# EAGLE design AudioXtreamer_Ymh01x (EAGLE 9.3.0)
AUTHOR: H.H.S.S.; WEB_ADDR: github.com/eltortugo/audioxtreamer

## Sheet 1 of 2
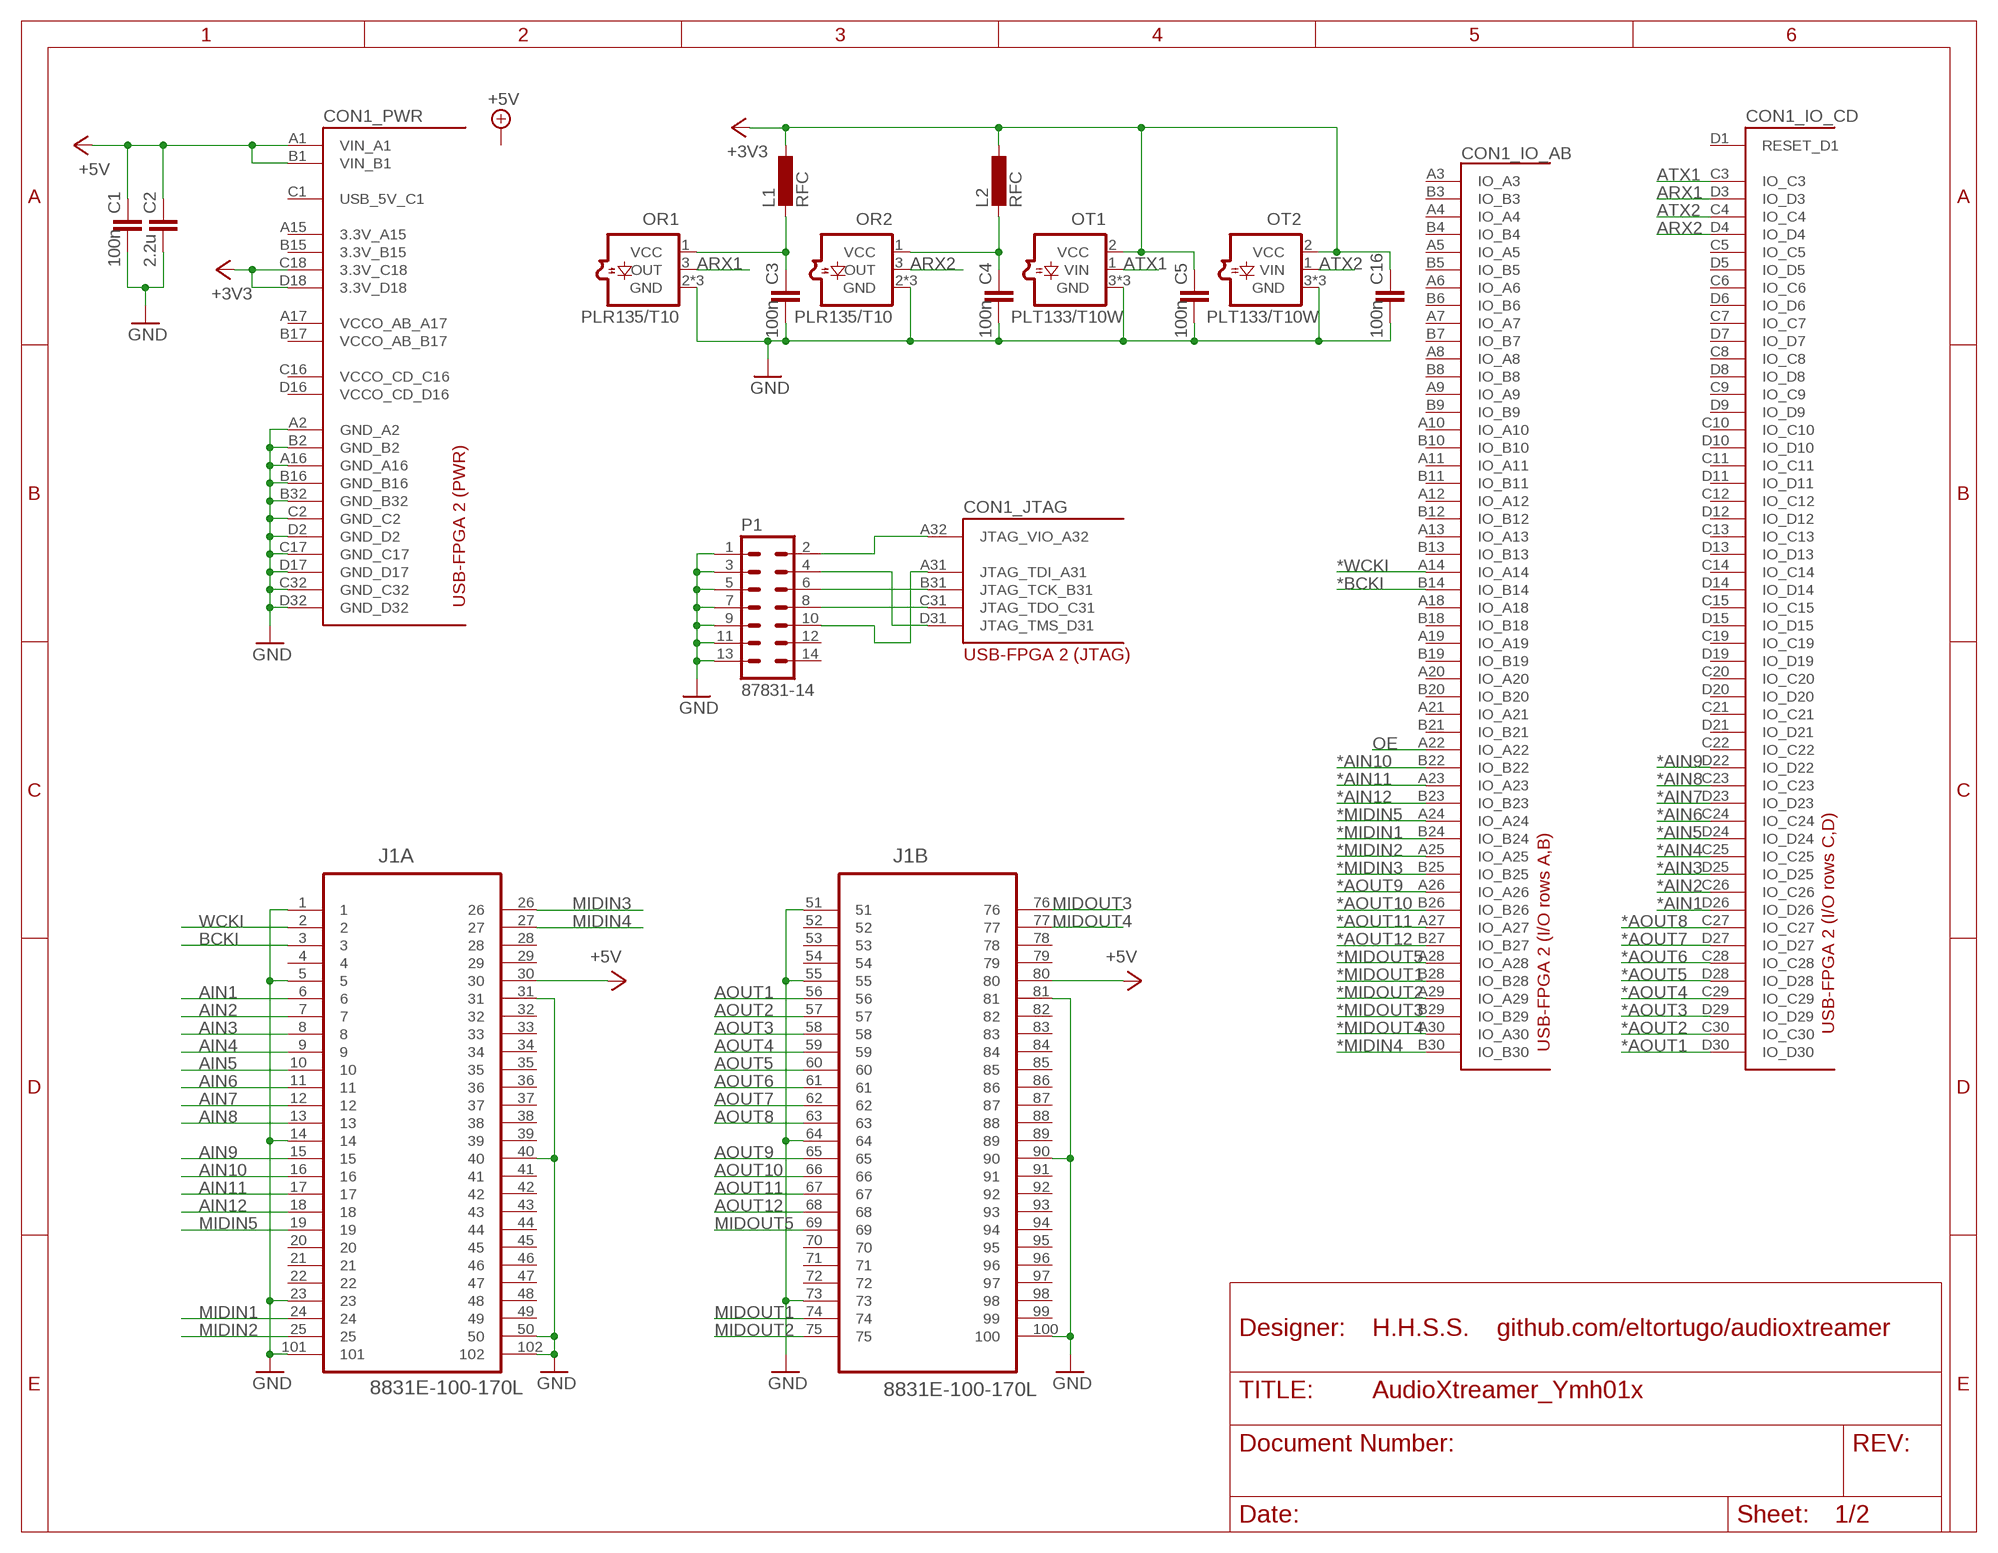
[diagram p0: schematic, sheet 1]
FRAME1 (FRAME_A_L): AUTHOR: H.H.S.S.; WEB_ADDR: github.com/eltortugo/audioxtreamer

### Parts
C1  100n  C-EUC0603  [C0603]
C2  2.2u  C-EUC0603  [C0603]
C3  100n  C-EUC0603  [C0603]
C4  100n  C-EUC0603  [C0603]
C5  100n  C-EUC0603  [C0603]
C16  100n  C-EUC0603  [C0603]
CON1  USB-FPGA-2THT  [USB-FPGA-2-THT]
J1  8831E-100-170L  [KEL_8831E-100-170L]
L1  RFC  L-EUL2012C  [L2012C]
L2  RFC  L-EUL2012C  [L2012C]
OR1  PLR135/T10  [PLR135/T10]
OR2  PLR135/T10  [PLR135/T10]
OT1  PLT133/T10W  [PLT133/T10]
OT2  PLT133/T10W  [PLT133/T10]
P1  87831-14  [87831-14]

### Nets
*AIN1: CON1.D26(_IO_CD:IO_D26) ; also sheet 2
*AIN2: CON1.C26(_IO_CD:IO_C26) ; also sheet 2
*AIN3: CON1.D25(_IO_CD:IO_D25) ; also sheet 2
*AIN4: CON1.C25(_IO_CD:IO_C25) ; also sheet 2
*AIN5: CON1.D24(_IO_CD:IO_D24) ; also sheet 2
*AIN6: CON1.C24(_IO_CD:IO_C24) ; also sheet 2
*AIN7: CON1.D23(_IO_CD:IO_D23) ; also sheet 2
*AIN8: CON1.C23(_IO_CD:IO_C23) ; also sheet 2
*AIN9: CON1.D22(_IO_CD:IO_D22) ; also sheet 2
*AIN10: CON1.B22(_IO_AB:IO_B22) ; also sheet 2
*AIN11: CON1.A23(_IO_AB:IO_A23) ; also sheet 2
*AIN12: CON1.B23(_IO_AB:IO_B23) ; also sheet 2
*AOUT1: CON1.D30(_IO_CD:IO_D30) ; also sheet 2
*AOUT2: CON1.C30(_IO_CD:IO_C30) ; also sheet 2
*AOUT3: CON1.D29(_IO_CD:IO_D29) ; also sheet 2
*AOUT4: CON1.C29(_IO_CD:IO_C29) ; also sheet 2
*AOUT5: CON1.D28(_IO_CD:IO_D28) ; also sheet 2
*AOUT6: CON1.C28(_IO_CD:IO_C28) ; also sheet 2
*AOUT7: CON1.D27(_IO_CD:IO_D27) ; also sheet 2
*AOUT8: CON1.C27(_IO_CD:IO_C27) ; also sheet 2
*AOUT9: CON1.A26(_IO_AB:IO_A26) ; also sheet 2
*AOUT10: CON1.B26(_IO_AB:IO_B26) ; also sheet 2
*AOUT11: CON1.A27(_IO_AB:IO_A27) ; also sheet 2
*AOUT12: CON1.B27(_IO_AB:IO_B27) ; also sheet 2
*BCKI: CON1.B14(_IO_AB:IO_B14) ; also sheet 2
*MIDIN1: CON1.B24(_IO_AB:IO_B24) ; also sheet 2
*MIDIN2: CON1.A25(_IO_AB:IO_A25) ; also sheet 2
*MIDIN3: CON1.B25(_IO_AB:IO_B25) ; also sheet 2
*MIDIN4: CON1.B30(_IO_AB:IO_B30) ; also sheet 2
*MIDIN5: CON1.A24(_IO_AB:IO_A24) ; also sheet 2
*MIDOUT1: CON1.B28(_IO_AB:IO_B28) ; also sheet 2
*MIDOUT2: CON1.A29(_IO_AB:IO_A29) ; also sheet 2
*MIDOUT3: CON1.B29(_IO_AB:IO_B29) ; also sheet 2
*MIDOUT4: CON1.A30(_IO_AB:IO_A30) ; also sheet 2
*MIDOUT5: CON1.A28(_IO_AB:IO_A28) ; also sheet 2
*WCKI: CON1.A14(_IO_AB:IO_A14) ; also sheet 2
+3V3: C5.1 C16.1 CON1.C18(_PWR:3.3V_C18) CON1.D18(_PWR:3.3V_D18) L1.1 L2.1 OT1.2(VCC) OT2.2(VCC) ; also sheet 2
+5V: C1.1 C2.1 CON1.A1(_PWR:VIN_A1) CON1.B1(_PWR:VIN_B1) J1.30 J1.80 ; also sheet 2
AIN1: J1.6 ; also sheet 2
AIN2: J1.7 ; also sheet 2
AIN3: J1.8 ; also sheet 2
AIN4: J1.9 ; also sheet 2
AIN5: J1.10 ; also sheet 2
AIN6: J1.11 ; also sheet 2
AIN7: J1.12 ; also sheet 2
AIN8: J1.13 ; also sheet 2
AIN9: J1.15 ; also sheet 2
AIN10: J1.16 ; also sheet 2
AIN11: J1.17 ; also sheet 2
AIN12: J1.18 ; also sheet 2
AOUT1: J1.56 ; also sheet 2
AOUT2: J1.57 ; also sheet 2
AOUT3: J1.58 ; also sheet 2
AOUT4: J1.59 ; also sheet 2
AOUT5: J1.60 ; also sheet 2
AOUT6: J1.61 ; also sheet 2
AOUT7: J1.62 ; also sheet 2
AOUT8: J1.63 ; also sheet 2
AOUT9: J1.65 ; also sheet 2
AOUT10: J1.66 ; also sheet 2
AOUT11: J1.67 ; also sheet 2
AOUT12: J1.68 ; also sheet 2
ARX1: CON1.D3(_IO_CD:IO_D3) OR1.3(OUT)
ARX2: CON1.D4(_IO_CD:IO_D4) OR2.3(OUT)
ATX1: CON1.C3(_IO_CD:IO_C3) OT1.1(VIN)
ATX2: CON1.C4(_IO_CD:IO_C4) OT2.1(VIN)
BCKI: J1.3 ; also sheet 2
GND: C1.2 C2.2 C3.2 C4.2 C5.2 C16.2 CON1.A2(_PWR:GND_A2) CON1.A16(_PWR:GND_A16) CON1.B2(_PWR:GND_B2) CON1.B16(_PWR:GND_B16) CON1.B32(_PWR:GND_B32) CON1.C2(_PWR:GND_C2) CON1.C17(_PWR:GND_C17) CON1.C32(_PWR:GND_C32) CON1.D2(_PWR:GND_D2) CON1.D17(_PWR:GND_D17) CON1.D32(_PWR:GND_D32) J1.1 J1.5 J1.14 J1.23 J1.31 J1.40 J1.50 J1.51 J1.55 J1.64 J1.73 J1.81 J1.90 J1.100 J1.101 J1.102 OR1.2(GND) OR1.NC1(GND) OR1.NC2(GND) OR2.2(GND) OR2.NC1(GND) OR2.NC2(GND) OT1.3(GND) OT1.NC1(GND) OT1.NC2(GND) OT2.3(GND) OT2.NC1(GND) OT2.NC2(GND) P1.1 P1.3 P1.5 P1.7 P1.9 P1.11 P1.13 ; also sheet 2
MIDIN1: J1.24 ; also sheet 2
MIDIN2: J1.25 ; also sheet 2
MIDIN3: J1.26 ; also sheet 2
MIDIN4: J1.27 ; also sheet 2
MIDIN5: J1.19 ; also sheet 2
MIDOUT1: J1.74 ; also sheet 2
MIDOUT2: J1.75 ; also sheet 2
MIDOUT3: J1.76 ; also sheet 2
MIDOUT4: J1.77 ; also sheet 2
MIDOUT5: J1.69 ; also sheet 2
N$1: CON1.A32(_JTAG:JTAG_VIO_A32) P1.2
N$2: CON1.D31(_JTAG:JTAG_TMS_D31) P1.4
N$3: CON1.B31(_JTAG:JTAG_TCK_B31) P1.6
N$4: CON1.C31(_JTAG:JTAG_TDO_C31) P1.8
N$5: CON1.A31(_JTAG:JTAG_TDI_A31) P1.10
N$7: C3.1 L1.2 OR1.1(VCC)
N$8: C4.1 L2.2 OR2.1(VCC)
OE: CON1.A22(_IO_AB:IO_A22) ; also sheet 2
WCKI: J1.2 ; also sheet 2
Unconnected: CON1.A3(_IO_AB:IO_A3) CON1.A4(_IO_AB:IO_A4) CON1.A5(_IO_AB:IO_A5) CON1.A6(_IO_AB:IO_A6) CON1.A7(_IO_AB:IO_A7) CON1.A8(_IO_AB:IO_A8) CON1.A9(_IO_AB:IO_A9) CON1.A10(_IO_AB:IO_A10) CON1.A11(_IO_AB:IO_A11) CON1.A12(_IO_AB:IO_A12) CON1.A13(_IO_AB:IO_A13) CON1.A15(_PWR:3.3V_A15) CON1.A17(_PWR:VCCO_AB_A17) CON1.A18(_IO_AB:IO_A18) CON1.A19(_IO_AB:IO_A19) CON1.A20(_IO_AB:IO_A20) CON1.A21(_IO_AB:IO_A21) CON1.B3(_IO_AB:IO_B3) CON1.B4(_IO_AB:IO_B4) CON1.B5(_IO_AB:IO_B5) CON1.B6(_IO_AB:IO_B6) CON1.B7(_IO_AB:IO_B7) CON1.B8(_IO_AB:IO_B8) CON1.B9(_IO_AB:IO_B9) CON1.B10(_IO_AB:IO_B10) CON1.B11(_IO_AB:IO_B11) CON1.B12(_IO_AB:IO_B12) CON1.B13(_IO_AB:IO_B13) CON1.B15(_PWR:3.3V_B15) CON1.B17(_PWR:VCCO_AB_B17) CON1.B18(_IO_AB:IO_B18) CON1.B19(_IO_AB:IO_B19) CON1.B20(_IO_AB:IO_B20) CON1.B21(_IO_AB:IO_B21) CON1.C1(_PWR:USB_5V_C1) CON1.C5(_IO_CD:IO_C5) CON1.C6(_IO_CD:IO_C6) CON1.C7(_IO_CD:IO_C7) CON1.C8(_IO_CD:IO_C8) CON1.C9(_IO_CD:IO_C9) CON1.C10(_IO_CD:IO_C10) CON1.C11(_IO_CD:IO_C11) CON1.C12(_IO_CD:IO_C12) CON1.C13(_IO_CD:IO_C13) CON1.C14(_IO_CD:IO_C14) CON1.C15(_IO_CD:IO_C15) CON1.C16(_PWR:VCCO_CD_C16) CON1.C19(_IO_CD:IO_C19) CON1.C20(_IO_CD:IO_C20) CON1.C21(_IO_CD:IO_C21) CON1.C22(_IO_CD:IO_C22) CON1.D1(_IO_CD:RESET_D1) CON1.D5(_IO_CD:IO_D5) CON1.D6(_IO_CD:IO_D6) CON1.D7(_IO_CD:IO_D7) CON1.D8(_IO_CD:IO_D8) CON1.D9(_IO_CD:IO_D9) CON1.D10(_IO_CD:IO_D10) CON1.D11(_IO_CD:IO_D11) CON1.D12(_IO_CD:IO_D12) CON1.D13(_IO_CD:IO_D13) CON1.D14(_IO_CD:IO_D14) CON1.D15(_IO_CD:IO_D15) CON1.D16(_PWR:VCCO_CD_D16) CON1.D19(_IO_CD:IO_D19) CON1.D20(_IO_CD:IO_D20) CON1.D21(_IO_CD:IO_D21) J1.4 J1.20 J1.21 J1.22 J1.28 J1.29 J1.32 J1.33 J1.34 J1.35 J1.36 J1.37 J1.38 J1.39 J1.41 J1.42 J1.43 J1.44 J1.45 J1.46 J1.47 J1.48 J1.49 J1.52 J1.53 J1.54 J1.70 J1.71 J1.72 J1.78 J1.79 J1.82 J1.83 J1.84 J1.85 J1.86 J1.87 J1.88 J1.89 J1.91 J1.92 J1.93 J1.94 J1.95 J1.96 J1.97 J1.98 J1.99 P1.12 P1.14

### Notes on the sheet
- Designer:

## Sheet 2 of 2
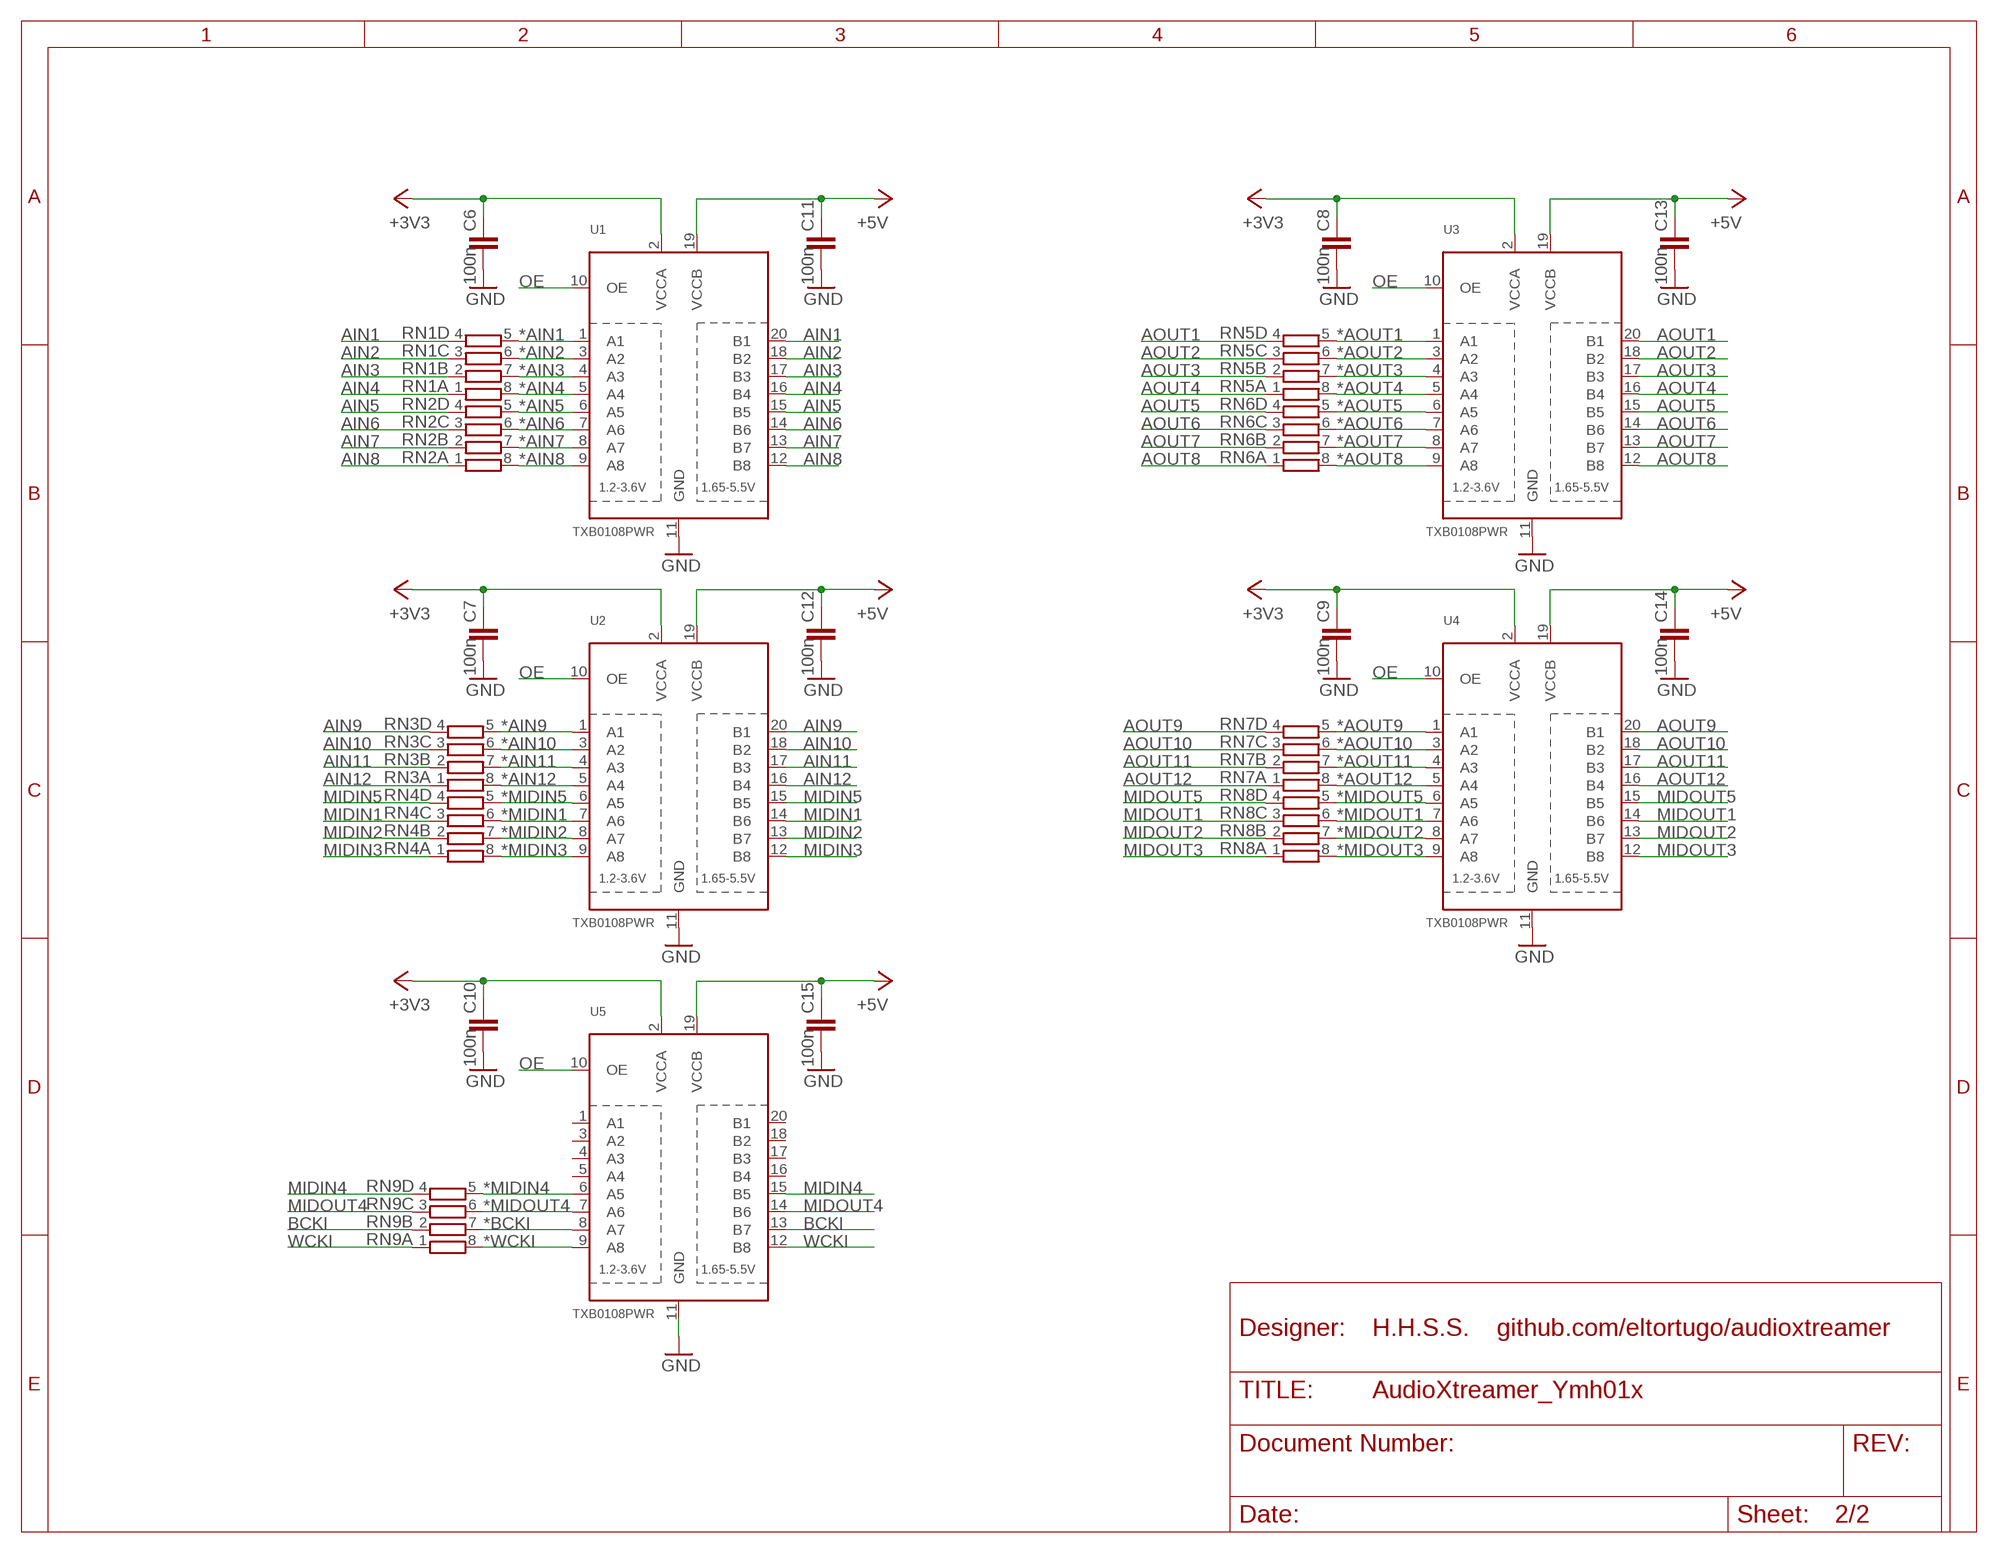
[diagram p1: schematic, sheet 2]
FRAME2 (FRAME_A_L): AUTHOR: H.Soto; WEB_ADDR: github.com/eltortugo/audioxtreamer
FRAME3 (FRAME_A_L): AUTHOR: >AUTHOR

### Parts
C6  100n  C-EUC0603  [C0603]
C7  100n  C-EUC0603  [C0603]
C8  100n  C-EUC0603  [C0603]
C9  100n  C-EUC0603  [C0603]
C10  100n  C-EUC0603  [C0603]
C11  100n  C-EUC0603  [C0603]
C12  100n  C-EUC0603  [C0603]
C13  100n  C-EUC0603  [C0603]
C14  100n  C-EUC0603  [C0603]
C15  100n  C-EUC0603  [C0603]
RN1  4R-N0603-ARC  [0603-ARC]
RN2  4R-N0603-ARC  [0603-ARC]
RN3  4R-N0603-ARC  [0603-ARC]
RN4  4R-N0603-ARC  [0603-ARC]
RN5  4R-N0603-ARC  [0603-ARC]
RN6  4R-N0603-ARC  [0603-ARC]
RN7  4R-N0603-ARC  [0603-ARC]
RN8  4R-N0603-ARC  [0603-ARC]
RN9  4R-N0603-ARC  [0603-ARC]
U1  TXB0108PWR  [TSSOP20]
U2  TXB0108PWR  [TSSOP20]
U3  TXB0108PWR  [TSSOP20]
U4  TXB0108PWR  [TSSOP20]
U5  TXB0108PWR  [TSSOP20]

### Nets
*AIN1: RN1.5 U1.1(A1) ; also sheet 1
*AIN2: RN1.6 U1.3(A2) ; also sheet 1
*AIN3: RN1.7 U1.4(A3) ; also sheet 1
*AIN4: RN1.8 U1.5(A4) ; also sheet 1
*AIN5: RN2.5 U1.6(A5) ; also sheet 1
*AIN6: RN2.6 U1.7(A6) ; also sheet 1
*AIN7: RN2.7 U1.8(A7) ; also sheet 1
*AIN8: RN2.8 U1.9(A8) ; also sheet 1
*AIN9: RN3.5 U2.1(A1) ; also sheet 1
*AIN10: RN3.6 U2.3(A2) ; also sheet 1
*AIN11: RN3.7 U2.4(A3) ; also sheet 1
*AIN12: RN3.8 U2.5(A4) ; also sheet 1
*AOUT1: RN5.5 U3.1(A1) ; also sheet 1
*AOUT2: RN5.6 U3.3(A2) ; also sheet 1
*AOUT3: RN5.7 U3.4(A3) ; also sheet 1
*AOUT4: RN5.8 U3.5(A4) ; also sheet 1
*AOUT5: RN6.5 U3.6(A5) ; also sheet 1
*AOUT6: RN6.6 U3.7(A6) ; also sheet 1
*AOUT7: RN6.7 U3.8(A7) ; also sheet 1
*AOUT8: RN6.8 U3.9(A8) ; also sheet 1
*AOUT9: RN7.5 U4.1(A1) ; also sheet 1
*AOUT10: RN7.6 U4.3(A2) ; also sheet 1
*AOUT11: RN7.7 U4.4(A3) ; also sheet 1
*AOUT12: RN7.8 U4.5(A4) ; also sheet 1
*BCKI: RN9.7 U5.8(A7) ; also sheet 1
*MIDIN1: RN4.6 U2.7(A6) ; also sheet 1
*MIDIN2: RN4.7 U2.8(A7) ; also sheet 1
*MIDIN3: RN4.8 U2.9(A8) ; also sheet 1
*MIDIN4: RN9.5 U5.6(A5) ; also sheet 1
*MIDIN5: RN4.5 U2.6(A5) ; also sheet 1
*MIDOUT1: RN8.6 U4.7(A6) ; also sheet 1
*MIDOUT2: RN8.7 U4.8(A7) ; also sheet 1
*MIDOUT3: RN8.8 U4.9(A8) ; also sheet 1
*MIDOUT4: RN9.6 U5.7(A6) ; also sheet 1
*MIDOUT5: RN8.5 U4.6(A5) ; also sheet 1
*WCKI: RN9.8 U5.9(A8) ; also sheet 1
+3V3: C6.1 C7.1 C8.1 C9.1 C10.1 U1.2(VCCA) U2.2(VCCA) U3.2(VCCA) U4.2(VCCA) U5.2(VCCA) ; also sheet 1
+5V: C11.1 C12.1 C13.1 C14.1 C15.1 U1.19(VCCB) U2.19(VCCB) U3.19(VCCB) U4.19(VCCB) U5.19(VCCB) ; also sheet 1
AIN1: RN1.4 U1.20(B1) ; also sheet 1
AIN2: RN1.3 U1.18(B2) ; also sheet 1
AIN3: RN1.2 U1.17(B3) ; also sheet 1
AIN4: RN1.1 U1.16(B4) ; also sheet 1
AIN5: RN2.4 U1.15(B5) ; also sheet 1
AIN6: RN2.3 U1.14(B6) ; also sheet 1
AIN7: RN2.2 U1.13(B7) ; also sheet 1
AIN8: RN2.1 U1.12(B8) ; also sheet 1
AIN9: RN3.4 U2.20(B1) ; also sheet 1
AIN10: RN3.3 U2.18(B2) ; also sheet 1
AIN11: RN3.2 U2.17(B3) ; also sheet 1
AIN12: RN3.1 U2.16(B4) ; also sheet 1
AOUT1: RN5.4 U3.20(B1) ; also sheet 1
AOUT2: RN5.3 U3.18(B2) ; also sheet 1
AOUT3: RN5.2 U3.17(B3) ; also sheet 1
AOUT4: RN5.1 U3.16(B4) ; also sheet 1
AOUT5: RN6.4 U3.15(B5) ; also sheet 1
AOUT6: RN6.3 U3.14(B6) ; also sheet 1
AOUT7: RN6.2 U3.13(B7) ; also sheet 1
AOUT8: RN6.1 U3.12(B8) ; also sheet 1
AOUT9: RN7.4 U4.20(B1) ; also sheet 1
AOUT10: RN7.3 U4.18(B2) ; also sheet 1
AOUT11: RN7.2 U4.17(B3) ; also sheet 1
AOUT12: RN7.1 U4.16(B4) ; also sheet 1
BCKI: RN9.2 U5.13(B7) ; also sheet 1
GND: C6.2 C7.2 C8.2 C9.2 C10.2 C11.2 C12.2 C13.2 C14.2 C15.2 U1.11(GND) U2.11(GND) U3.11(GND) U4.11(GND) U5.11(GND) ; also sheet 1
MIDIN1: RN4.3 U2.14(B6) ; also sheet 1
MIDIN2: RN4.2 U2.13(B7) ; also sheet 1
MIDIN3: RN4.1 U2.12(B8) ; also sheet 1
MIDIN4: RN9.4 U5.15(B5) ; also sheet 1
MIDIN5: RN4.4 U2.15(B5) ; also sheet 1
MIDOUT1: RN8.3 U4.14(B6) ; also sheet 1
MIDOUT2: RN8.2 U4.13(B7) ; also sheet 1
MIDOUT3: RN8.1 U4.12(B8) ; also sheet 1
MIDOUT4: RN9.3 U5.14(B6) ; also sheet 1
MIDOUT5: RN8.4 U4.15(B5) ; also sheet 1
OE: U1.10(OE) U2.10(OE) U3.10(OE) U4.10(OE) U5.10(OE) ; also sheet 1
WCKI: RN9.1 U5.12(B8) ; also sheet 1
Unconnected: U5.1(A1) U5.3(A2) U5.4(A3) U5.5(A4) U5.16(B4) U5.17(B3) U5.18(B2) U5.20(B1)

### Notes on the sheet
- Designer:

## Library data of the parts
C1-C16 = rcl:C-EU: CAPACITOR, European symbol; SPICEPREFIX: C
CON1 = ztex-fpga-2:USB-FPGA-2
J1 = KEL:8831E-100-170L: CONN RCPT 1.27MM 100POS GOLD PCB; DESCRIPTION: CONN-100POS; MPN: KEL_8831E-100-170L; ROHS: Yes; SUPPLIER: KEL
L1 L2 = rcl:L-EU: INDUCTOR, European symbol; SPICEPREFIX: L
OR1 OR2 = everlight:PLR135/T10
OT1 OT2 = everlight:PLT133/T10W
P1 = con-molex-milli-grid:87831-14: HEADER
RN1-RN9 = resistor-dil:4R-N: Array Chip Resistor Source: RS Component / Phycomp; OC_FARNELL: unknown; OC_NEWARK: unknown
U1-U5 = adafruit:TXB0108PWR: 8-Bit Bi-Directional Level Shifter 1.2V-3.6V (VCCA) to 1.65V-5.5V (VCCB) bi-directional level shifter with auto direction sensing. Max data rate - VCCA 1.8V: 20Mbps (50ns), VCCA 3.3V: 100Mbps (10ns) Digikey: 296-21527-1-ND

## Net classes
1 +5V: width 0.635 mm

## Board
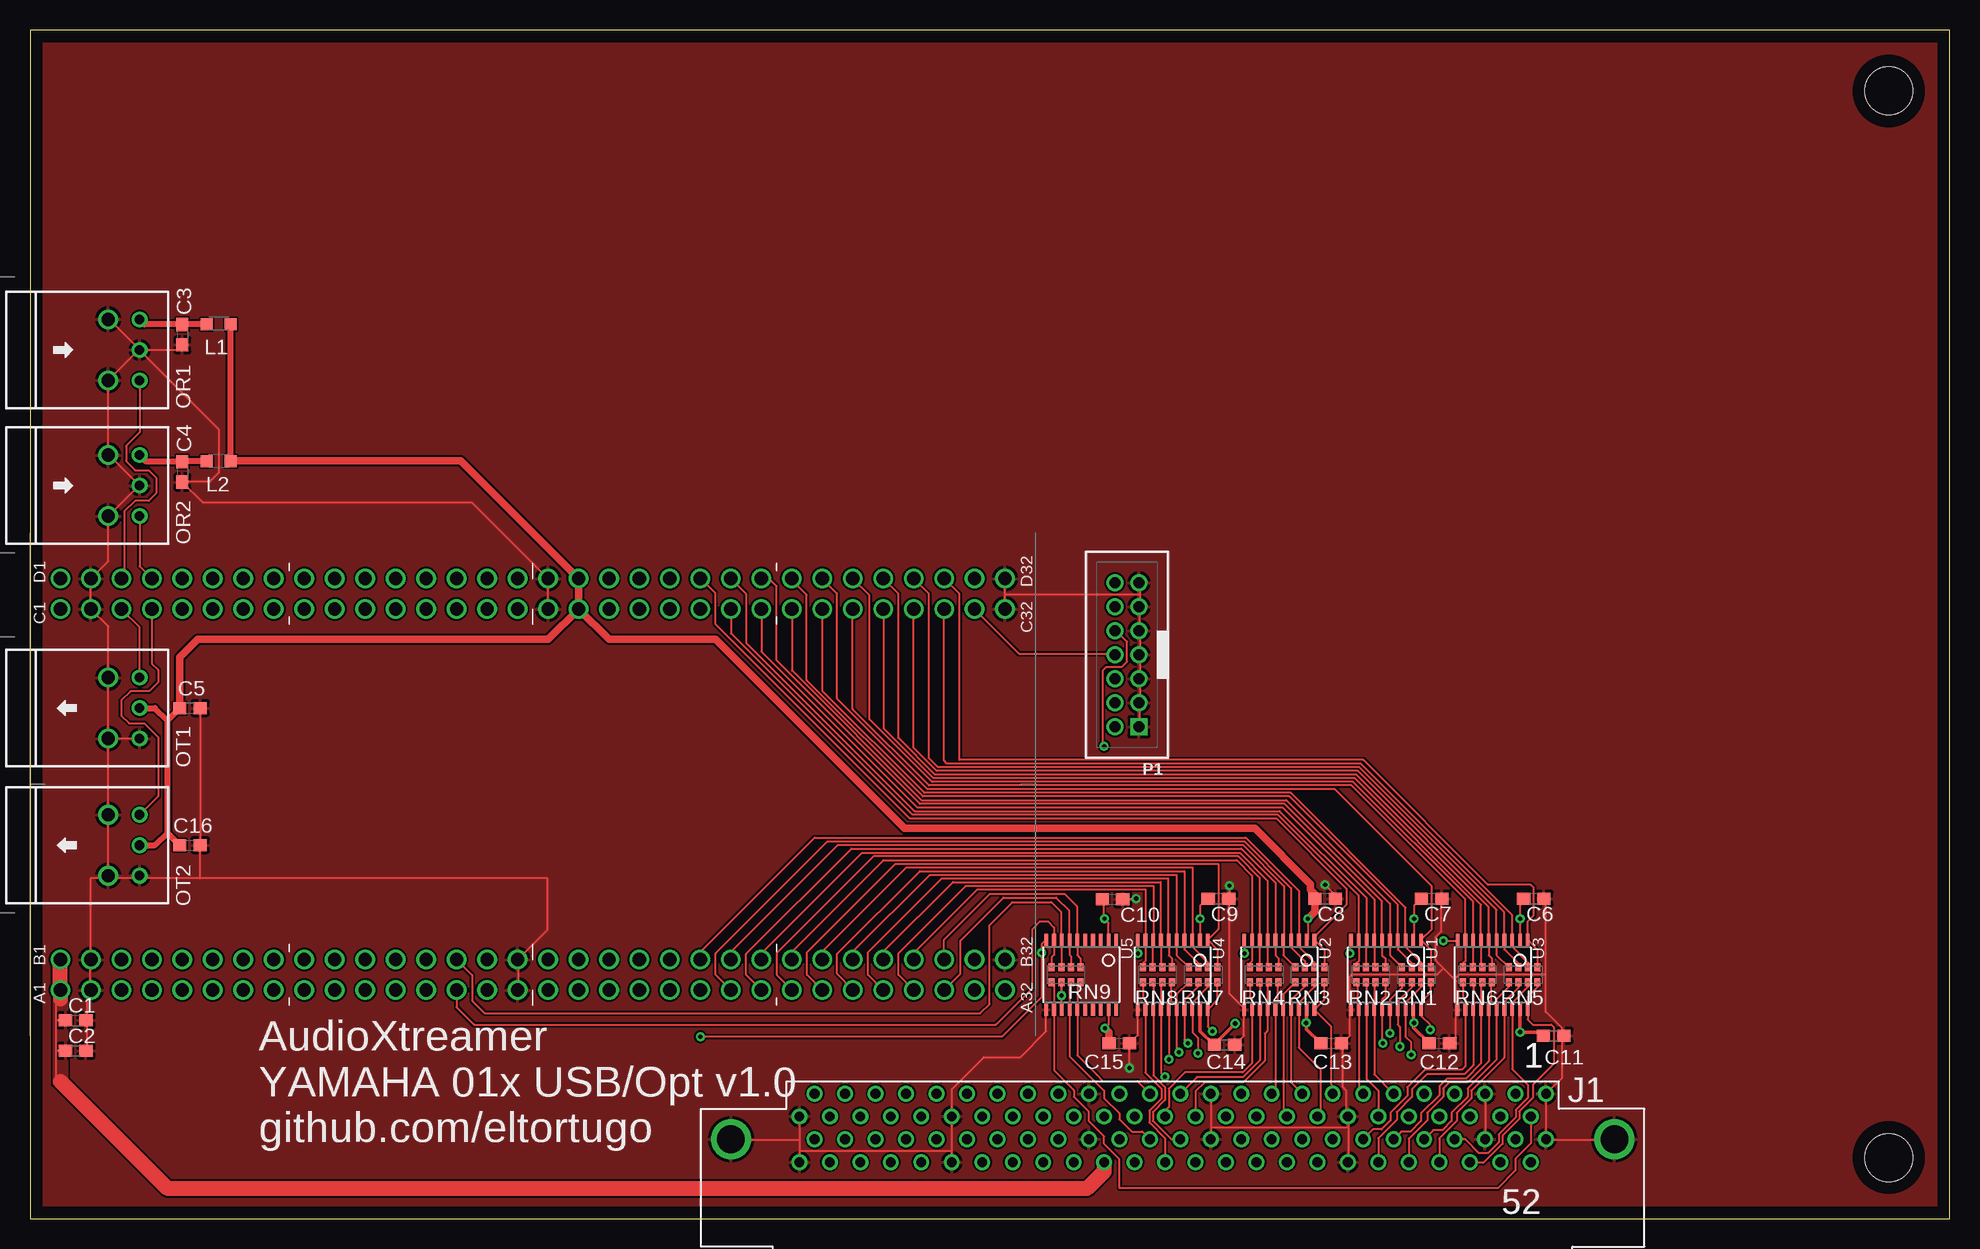
[diagram p2: board, top side]
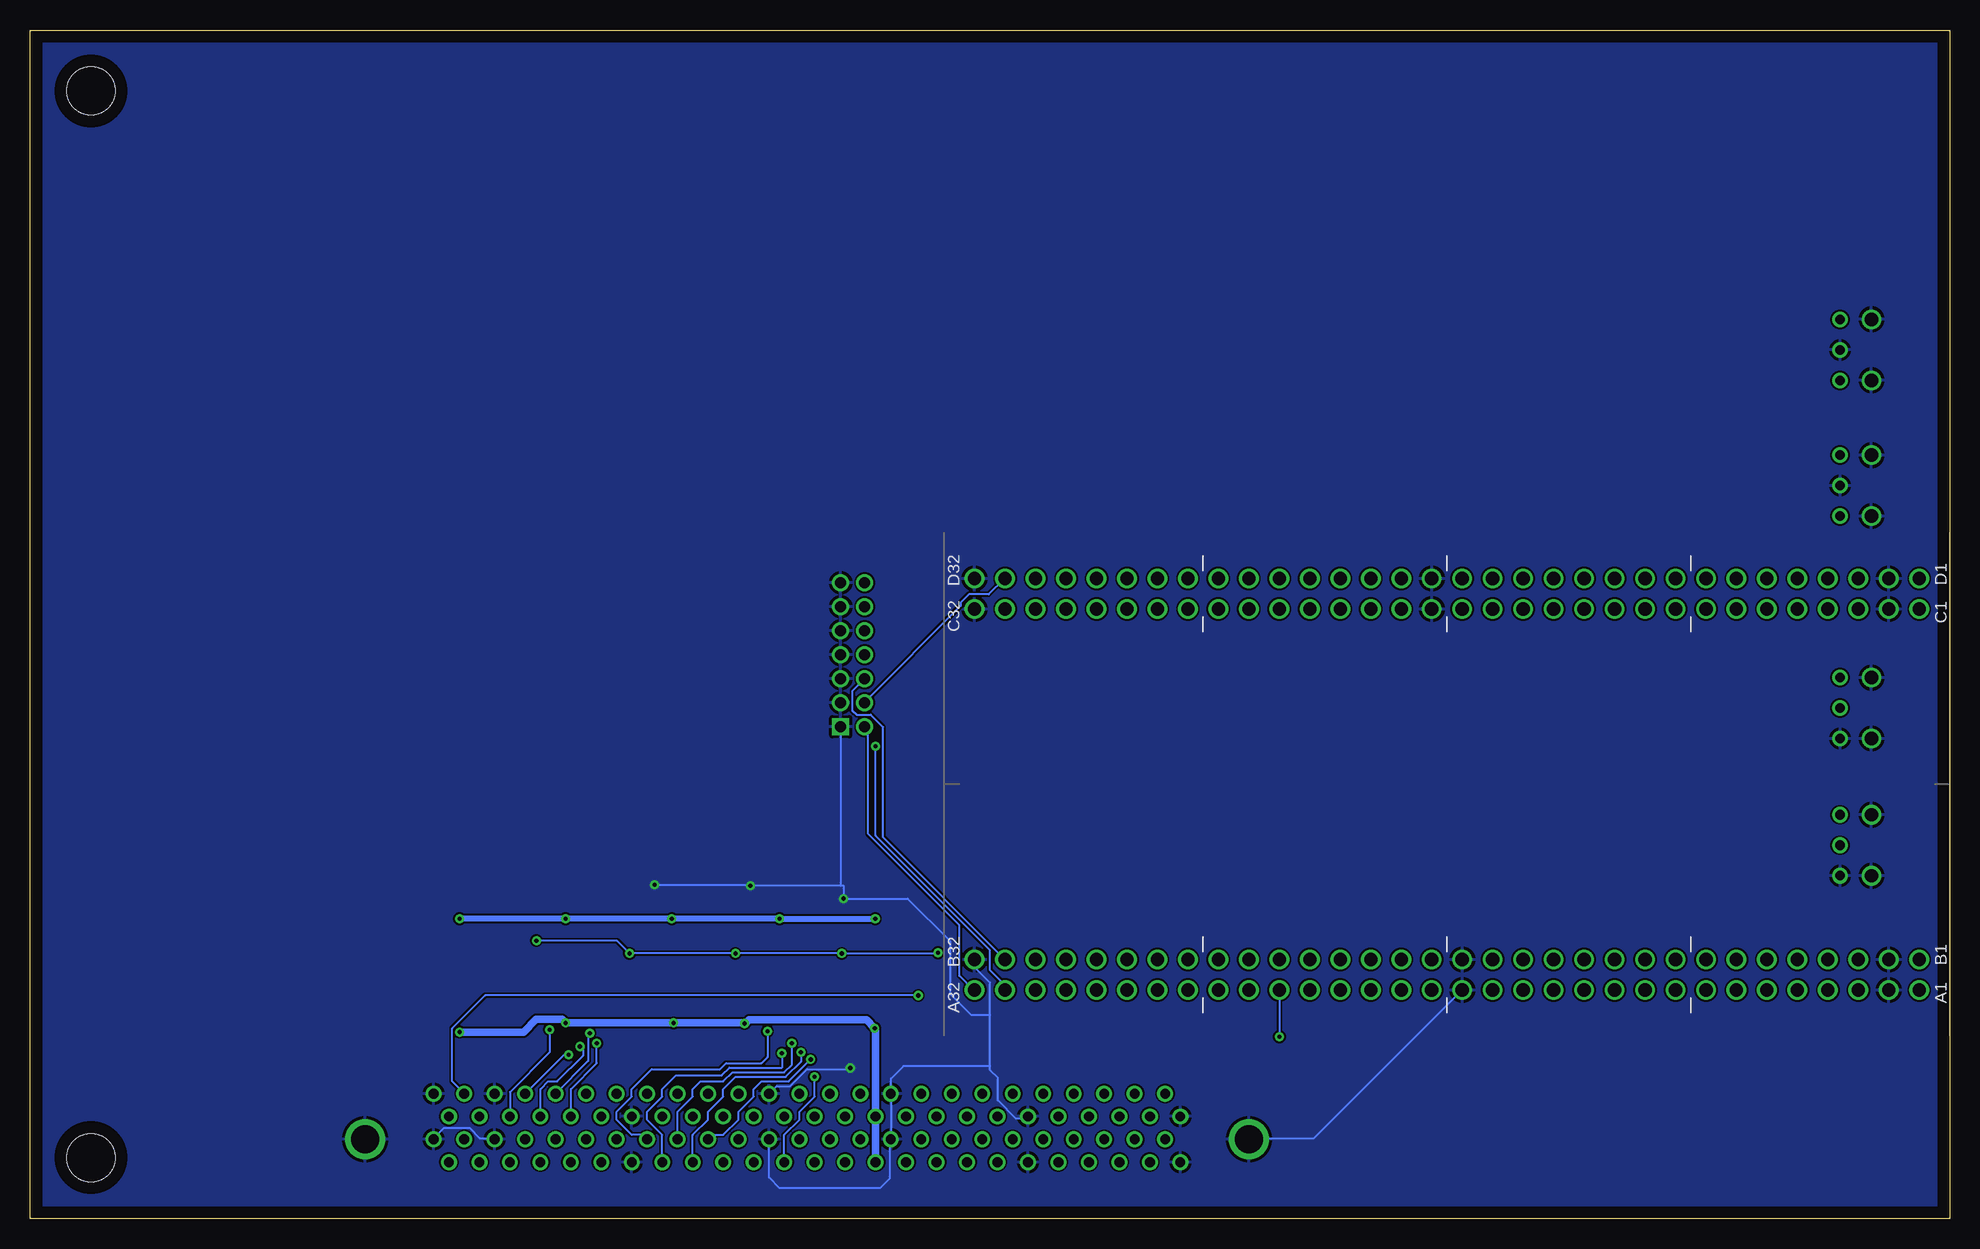
[diagram p3: board, bottom side, seen from below]

Size 160.02 x 99.05 mm. Coordinates in mm from the lower left corner, seen from the top.
Outline: 0,0 160.02,0 160.02,99.05 0,99.05 0,0
Copper layers (1*16): Top 0.035mm / dielectric 1.5mm / Bottom 0.035mm
Design rules "default *": minimum track width 6mil, minimum drill 0.35mm, track to track 6mil, track to pad 8mil, pad to pad 6mil, via to via 6mil, smd to smd 6mil, copper to edge 40mil, drill to drill 6mil, minimum pad ring 10mil, minimum via ring 8mil, stop-mask expansion 4mil, vias tented up to drill 0mil, thermal gap 10mil
Holes 4 mm at 154.94,5.08 154.94,93.98

### Footprints (pad centres in the part's own frame; a part is rotated, then mirrored left to right if it is on the bottom)
C0603 = smd 1.1 x 1: 1 -0.85,0; 2 0.85,0
USB-FPGA-2-THT = drill 1.1: A1 2.54,2.54; A2 5.08,2.54; A3 7.62,2.54; A4 10.16,2.54; A5 12.7,2.54; A6 15.24,2.54; A7 17.78,2.54; A8 20.32,2.54; A9 22.86,2.54; A10 25.4,2.54; A11 27.94,2.54; A12 30.48,2.54; A13 33.02,2.54; A14 35.56,2.54; A15 38.1,2.54; A16 40.64,2.54; A17 43.18,2.54; A18 45.72,2.54; A19 48.26,2.54; A20 50.8,2.54; A21 53.34,2.54; A22 55.88,2.54; A23 58.42,2.54; A24 60.96,2.54; A25 63.5,2.54; A26 66.04,2.54; A27 68.58,2.54; A28 71.12,2.54; A29 73.66,2.54; A30 76.2,2.54; A31 78.74,2.54; A32 81.28,2.54; B1 2.54,5.08; B2 5.08,5.08; B3 7.62,5.08; B4 10.16,5.08; B5 12.7,5.08; B6 15.24,5.08; B7 17.78,5.08; B8 20.32,5.08; B9 22.86,5.08; B10 25.4,5.08; B11 27.94,5.08; B12 30.48,5.08; B13 33.02,5.08; B14 35.56,5.08; B15 38.1,5.08; B16 40.64,5.08; B17 43.18,5.08; B18 45.72,5.08; B19 48.26,5.08; B20 50.8,5.08; B21 53.34,5.08; B22 55.88,5.08; B23 58.42,5.08; B24 60.96,5.08; B25 63.5,5.08; B26 66.04,5.08; B27 68.58,5.08; B28 71.12,5.08; B29 73.66,5.08; B30 76.2,5.08; B31 78.74,5.08; B32 81.28,5.08; C1 2.54,34.29; C2 5.08,34.29; C3 7.62,34.29; C4 10.16,34.29; C5 12.7,34.29; C6 15.24,34.29; C7 17.78,34.29; C8 20.32,34.29; C9 22.86,34.29; C10 25.4,34.29; C11 27.94,34.29; C12 30.48,34.29; C13 33.02,34.29; C14 35.56,34.29; C15 38.1,34.29; C16 40.64,34.29; C17 43.18,34.29; C18 45.72,34.29; C19 48.26,34.29; C20 50.8,34.29; C21 53.34,34.29; C22 55.88,34.29; C23 58.42,34.29; C24 60.96,34.29; C25 63.5,34.29; C26 66.04,34.29; C27 68.58,34.29; C28 71.12,34.29; C29 73.66,34.29; C30 76.2,34.29; C31 78.74,34.29; C32 81.28,34.29; D1 2.54,36.83; D2 5.08,36.83; D3 7.62,36.83; D4 10.16,36.83; D5 12.7,36.83; D6 15.24,36.83; D7 17.78,36.83; D8 20.32,36.83; D9 22.86,36.83; D10 25.4,36.83; D11 27.94,36.83; D12 30.48,36.83; D13 33.02,36.83; D14 35.56,36.83; D15 38.1,36.83; D16 40.64,36.83; D17 43.18,36.83; D18 45.72,36.83; D19 48.26,36.83; D20 50.8,36.83; D21 53.34,36.83; D22 55.88,36.83; D23 58.42,36.83; D24 60.96,36.83; D25 63.5,36.83; D26 66.04,36.83; D27 68.58,36.83; D28 71.12,36.83; D29 73.66,36.83; D30 76.2,36.83; D31 78.74,36.83; D32 81.28,36.83
KEL_8831E-100-170L = drill 0.813: 1 31.115,3.81; 2 29.845,1.905; 3 28.575,3.81; 4 27.305,1.905; 5 26.035,3.81; 6 24.765,1.905; 7 23.495,3.81; 8 22.225,1.905; 9 20.955,3.81; 10 19.685,1.905; 11 18.415,3.81; 12 17.145,1.905; 13 15.875,3.81; 14 14.605,1.905; 15 13.335,3.81; 16 12.065,1.905; 17 10.795,3.81; 18 9.525,1.905; 19 8.255,3.81; 20 6.985,1.905; 21 5.715,3.81; 22 4.445,1.905; 23 3.175,3.81; 24 1.905,1.905; 25 0.635,3.81; 26 -0.635,1.905; 27 -1.905,3.81; 28 -3.175,1.905; 29 -4.445,3.81; 30 -5.715,1.905; 31 -6.985,3.81; 32 -8.255,1.905; 33 -9.525,3.81; 34 -10.795,1.905; 35 -12.065,3.81; 36 -13.335,1.905; 37 -14.605,3.81; 38 -15.875,1.905; 39 -17.145,3.81; 40 -18.415,1.905; 41 -19.685,3.81; 42 -20.955,1.905; 43 -22.225,3.81; 44 -23.495,1.905; 45 -24.765,3.81; 46 -26.035,1.905; 47 -27.305,3.81; 48 -28.575,1.905; 49 -29.845,3.81; 50 -31.115,1.905; 51 31.115,0; 52 29.845,-1.905; 53 28.575,0; 54 27.305,-1.905; 55 26.035,0; 56 24.765,-1.905; 57 23.495,0; 58 22.225,-1.905; 59 20.955,0; 60 19.685,-1.905; 61 18.415,0; 62 17.145,-1.905; 63 15.875,0; 64 14.605,-1.905; 65 13.335,0; 66 12.065,-1.905; 67 10.795,0; 68 9.525,-1.905; 69 8.255,0; 70 6.985,-1.905; 71 5.715,0; 72 4.445,-1.905; 73 3.175,0; 74 1.905,-1.905; 75 0.635,0; 76 -0.635,-1.905; 77 -1.905,0; 78 -3.175,-1.905; 79 -4.445,0; 80 -5.715,-1.905; 81 -6.985,0; 82 -8.255,-1.905; 83 -9.525,0; 84 -10.795,-1.905; 85 -12.065,0; 86 -13.335,-1.905; 87 -14.605,0; 88 -15.875,-1.905; 89 -17.145,0; 90 -18.415,-1.905; 91 -19.685,0; 92 -20.955,-1.905; 93 -22.225,0; 94 -23.495,-1.905; 95 -24.765,0; 96 -26.035,-1.905; 97 -27.305,0; 98 -28.575,-1.905; 99 -29.845,0; 100 -31.115,-1.905 | drill 2.311: 101 -36.83,0; 102 36.83,0
L2012C = smd 1 x 1: 1 -1,0; 2 1,0
PLR135/T10 = drill 0.8 pad 1.27: 1 -2.54,8.76; 2 0,8.76; 3 2.54,8.76 | drill 1.1: NC1 -2.54,6.14; NC2 2.54,6.14
PLT133/T10 = drill 0.8 pad 1.27: 1 -2.54,8.76; 2 0,8.76; 3 2.54,8.76 | drill 1.1: NC1 -2.54,6.14; NC2 2.54,6.14
87831-14 = drill 0.914 square: 1 -6,-1 | drill 0.914: 2 -6,1; 3 -4,-1; 4 -4,1; 5 -2,-1; 6 -2,1; 7 0,-1; 8 0,1; 9 2,-1; 10 2,1; 11 4,-1; 12 4,1; 13 6,-1; 14 6,1
0603-ARC = smd 0.5 x 0.65: 1 -1.2,-0.625; 2 -0.4,-0.625; 3 0.4,-0.625; 4 1.2,-0.625; 5 1.2,0.625; 6 0.4,0.625; 7 -0.4,0.625; 8 -1.2,0.625
TSSOP20 = smd 0.305 x 0.991: 1 -2.925,-2.918; 2 -2.275,-2.918; 3 -1.625,-2.918; 4 -0.975,-2.918; 5 -0.325,-2.918; 6 0.325,-2.918; 7 0.975,-2.918; 8 1.625,-2.918; 9 2.275,-2.918; 10 2.925,-2.918; 11 2.925,2.918; 12 2.275,2.918; 13 1.625,2.918; 14 0.975,2.918; 15 0.325,2.918; 16 -0.325,2.918; 17 -0.975,2.918; 18 -1.625,2.918; 19 -2.275,2.918; 20 -2.925,2.918

### Placement (x,y rotation side)
C1  3.81,16.51 0 top
C2  3.81,13.97 0 top
C3  12.7,73.66 270 top
C4  12.7,62.23 270 top
C5  13.34,42.55 0 top
C6  125.35,26.67 0 top
C7  116.84,26.67 0 top
C8  107.95,26.67 0 top
C9  99.06,26.67 0 top
C10  90.23,26.61 0 top
C11  127,15.24 0 top
C12  117.47,14.61 0 top
C13  108.46,14.61 0 top
C14  99.57,14.48 0 top
C15  90.81,14.61 0 top
C16  13.34,31.11 0 top
CON1  0,16.51 0 top
J1  95.25,6.6 0 top
L1  15.75,74.55 180 top
L2  15.75,63.12 180 top
OR1  0.38,72.39 270 top
OR2  0.38,61.09 270 top
OT1  0.38,42.55 270 top
OT2  0.38,31.11 270 top
P1  91.44,46.99 90 top
RN1  115.57,20.32 0 top
RN2  111.76,20.32 0 top
RN3  106.68,20.32 0 top
RN4  102.87,20.32 0 top
RN5  124.46,20.32 0 top
RN6  120.65,20.32 0 top
RN7  97.79,20.32 0 top
RN8  93.98,20.32 0 top
RN9  86.36,20.32 0 top
U1  113.03,20.32 180 top
U2  104.14,20.32 180 top
U3  121.92,20.32 180 top
U4  95.25,20.32 180 top
U5  87.63,20.32 180 top

### Tracks (layer width: path | path; a pad name or v marks a point on that pad's centre or on a via)
*AIN1
  Top 0.152: RN1.5 116.77,22.42 U1.1 116.84,24.12 116.84,27.72 108.77,35.79 74.81,35.79 67.27,43.33 67.27,52.07 66.04,53.31 CON1.D26
*AIN2
  Top 0.152: RN1.6 115.97,21.33 114.66,22.64 U1.3 114.66,25.91 105.09,35.48 74.56,35.48 66.04,44 CON1.C26
*AIN3
  Top 0.152: RN1.7 115.17,21.28 114,22.44 U1.4 114,26.13 104.96,35.18 74.43,35.18 64.73,44.88 64.73,51.98 63.5,53.21 CON1.D25
*AIN4
  Top 0.152: RN1.8 113.36,21.96 U1.5 113.36,26.24 104.72,34.87 74.3,34.87 63.5,45.68 CON1.C25
*AIN5
  Top 0.152: RN2.5 112.96,21.69 112.7,21.94 U1.6 112.7,26.44 104.58,34.57 74.18,34.57 62.23,46.52 62.23,52.7 61.59,53.34 CON1.D24
*AIN6
  Top 0.152: RN2.6 112.06,21.05 U1.7 112.06,26.6 104.39,34.27 73.94,34.27 60.96,47.24 CON1.C24
*AIN7
  Top 0.152: RN2.7 111.36,23.19 U1.8 111.41,26.72 104.17,33.96 73.74,33.96 59.69,48.01 59.69,52.07 CON1.D23
*AIN8
  Top 0.152: RN2.8 110.56,21.27 110.75,21.46 U1.9 110.75,26.91 104.01,33.66 73.54,33.66 58.42,48.78 CON1.C23
*AIN9
  Top 0.152: RN3.5 107.88,22.42 U2.1 107.06,23.49 109.73,26.15 109.73,27.51 103.89,33.35 73.33,33.35 57.12,49.55 57.12,52.15 55.93,53.34 CON1.D22
*AIN10
  Top 0.152: RN3.6 107.08,21.33 105.77,22.64 105.77,23.11 105.77,23.16 U2.3 105.79,23.26 105.79,27.3 101.35,31.75 65.41,31.75 55.88,22.23 CON1.B22
*AIN11
  Top 0.152: RN3.7 106.28,21.46 105.11,22.63 U2.4 105.11,27.55 101.22,31.45 66.5,31.45 57.15,22.1 57.15,20.32 CON1.A23
*AIN12
  Top 0.152: RN3.8 104.47,21.96 U2.5 104.52,23.29 104.52,27.71 101.09,31.14 67.33,31.14 58.42,22.23 CON1.B23
*AOUT1
  Top 0.152: RN5.5 125.66,22.42 U3.1 124.84,24.77 125.35,25.27 125.35,27.56 125.09,27.81 121.54,27.81 111.12,38.23 77.47,38.23 77.47,52.07 CON1.D30
*AOUT2
  Top 0.152: RN5.6 124.86,21.33 123.55,22.64 U3.3 123.55,25.3 110.92,37.92 76.45,37.92 76.2,38.18 CON1.C30
*AOUT3
  Top 0.152: RN5.7 124.06,21.28 122.89,22.44 U3.4 122.89,25.52 110.8,37.62 75.69,37.62 74.93,38.38 74.93,52.07 CON1.D29
*AOUT4
  Top 0.152: RN5.8 122.25,21.96 U3.5 122.25,25.74 110.67,37.31 75.57,37.31 73.66,39.22 CON1.C29
*AOUT5
  Top 0.152: RN6.5 121.85,21.69 121.59,21.94 U3.6 121.59,25.96 110.54,37.01 75.44,37.01 72.39,40.06 72.39,52.07 CON1.D28
*AOUT6
  Top 0.152: RN6.6 120.94,21.05 U3.7 120.94,26.18 110.42,36.7 75.31,36.7 71.16,40.86 71.16,50.76 CON1.C28
*AOUT7
  Top 0.152: RN6.7 120.25,23.19 U3.8 120.3,26.39 110.29,36.4 75.19,36.4 69.98,41.61 69.98,51.94 CON1.D27
*AOUT8
  Top 0.152: RN6.8 119.45,21.27 119.64,21.46 U3.9 119.64,26.61 110.16,36.09 74.94,36.09 68.58,42.45 CON1.C27
*AOUT9
  Top 0.152: RN7.5 98.99,22.42 U4.1 99.06,24.12 99.06,29.57 72.14,29.57 64.77,22.19 64.77,20.32 CON1.A26
*AOUT10
  Top 0.152: U4.3 96.88,22.86 | 96.88,22.86 96.88,22.64 98.19,21.33 RN7.6 | 96.88,22.86 96.9,22.89 96.9,29.26 73.08,29.26 66.04,22.23 CON1.B26
*AOUT11
  Top 0.152: RN7.7 97.39,21.28 96.22,22.44 U4.4 96.22,28.96 74.17,28.96 67.27,22.06 67.27,20.39 68.58,19.08 CON1.A27
*AOUT12
  Top 0.152: RN7.8 95.58,21.96 U4.5 95.58,28.65 75.01,28.65 68.58,22.23 CON1.B27
*BCKI
  Top 0.152: CON1.B14 36.85,20.3 36.85,18.14 37.9,17.09 79.2,17.09 79.98,17.88 79.98,24.46 81.89,26.36 85.14,26.36 85.98,25.53 85.98,23.26 U5.8 85.96,23.19 RN9.7
*MIDIN1
  Top 0.152: RN4.6 103.17,21.05 U2.7 103.17,28.15 100.84,30.48 69.34,30.48 60.96,22.1 CON1.B24
*MIDIN2
  Top 0.152: RN4.7 102.47,23.19 U2.8 102.52,28.37 100.71,30.18 70.31,30.18 62.23,22.1 62.23,20.32 CON1.A25
*MIDIN3
  Top 0.152: RN4.8 101.67,21.27 101.86,21.46 U2.9 101.86,28.59 100.58,29.87 71.14,29.87 63.5,22.23 CON1.B25
*MIDIN4
  Top 0.152: CON1.B30 76.2,23.24 80.01,27.05 86.23,27.05 87.31,25.98 U5.6 87.31,21.97 87.56,21.71 RN9.5
*MIDIN5
  Top 0.152: RN4.5 104.07,21.69 103.81,21.94 U2.6 103.81,27.99 100.97,30.84 68.46,30.84 59.69,22.06 59.69,20.32 CON1.A24
*MIDOUT1
  Top 0.152: RN8.6 94.28,21.05 U4.7 94.23,23.28 94.23,28.04 76.94,28.04 71.12,22.23 CON1.B28
*MIDOUT2
  Top 0.152: RN8.7 93.58,23.19 U4.8 93.64,23.25 93.64,27.74 78.03,27.74 72.39,22.1 72.39,20.32 CON1.A29
*MIDOUT3
  Top 0.152: RN8.8 92.78,21.27 92.97,21.46 U4.9 92.97,27.43 78.99,27.43 73.66,22.1 CON1.B29
*MIDOUT4
  Top 0.152: CON1.A30 77.56,20.41 77.56,23.17 81.14,26.75 85.52,26.75 86.63,25.64 86.63,23.26 U5.7 86.66,21.97 86.76,21.86 RN9.6
*MIDOUT5
  Top 0.152: RN8.5 95.18,21.69 94.92,21.94 U4.6 94.87,23.29 94.87,28.35 76,28.35 69.85,22.19 69.85,20.32 CON1.A28
*WCKI
  Top 0.152: CON1.A14 35.56,17.63 37.03,16.15 80.51,16.15 83.57,19.21 83.57,24.13 84.2,24.77 84.84,24.77 85.36,24.25 U5.9 85.36,21.97 85.16,21.77 RN9.8
+3V3  (via drill 0.35)
  Top 0.152: U1.2 115.37,23.32 v115.37,24.99 115.37,26.06 115.98,26.67 C7.1 | v106.53,24.99 106.53,23.32 U2.2 | U3.2 124.21,23.32 v124.21,24.99 124.21,26.52 124.36,26.67 C6.1 | C10.1 89.46,26.61 89.46,24.99 v89.56,24.99 89.91,24.65 U5.2 | U4.2 97.54,23.32 v97.54,24.99 97.54,26.06 98.15,26.67 C9.1
  Top 0.508: 11.47,41.49 10.41,42.55 OT1.2 | 11.47,32.17 10.41,31.11 OT2.2 | 11.47,32.17 11.47,41.49 | C5.1 11.47,41.53 11.47,41.49 | 11.47,32.17 11.47,32.13 C16.1 | L2.1 L1.1
  Top 0.635: CON1.C18 CON1.D18 35.92,63.14 16.77,63.14 L2.1 | CON1.C18 48.26,48.26 57.15,48.26 72.9,32.51 102.11,32.51 106.75,27.87 106.75,27.39 107.1,27.03 C8.1 107.1,25.57 v106.53,24.99 | CON1.C18 43.18,48.26 13.97,48.26 12.48,46.77 C5.1
  Bottom 0.508: v89.56,24.99 v97.54,24.99 v106.53,24.99 v115.37,24.99 v124.21,24.99
+5V  (via drill 0.35)
  Top 0.152: 124.21,17.37 U3.19 | 126.03,15.24 C11.1 | U5.19 89.91,16.17 v89.61,15.88 | 2.54,18.29 2.79,18.03 2.41,18.03 2.16,17.78 2.16,16.51 | 2.16,16.51 2.16,13.97 | 2.16,13.97 2.16,11.81 2.54,11.43 | C1.1 2.16,16.51 | C2.1 2.16,13.97
  Top 0.305: v100.46,16.26 98.72,14.52 C14.1 98.68,14.48 97.53,15.63 U4.19 | U2.19 106.42,16.35 | 106.42,16.35 v106.38,16.31 | C13.1 106.42,15.8 106.42,16.35 | U1.19 115.31,16.37 | 115.31,16.37 v115.37,16.31 | C12.1 115.31,15.93 115.31,16.37 | U3.19 124.19,15.56 v124.21,15.54 125.84,15.54 C11.1
  Top 0.635: v89.61,15.88 89.95,15.53 C15.1
  Top 1.27: J1.80 89.53,3.92 88.1,2.49 11.48,2.49 2.54,11.43 | CON1.B1 CON1.A1 2.54,18.29
  Bottom 0.635: v124.21,15.54 118.88,15.54 117.83,16.6 115.66,16.6 v115.37,16.31 v106.38,16.31 100.51,16.31 v100.46,16.26 100.39,16.26 100.07,16.57 90.31,16.57 v89.61,15.88 89.53,15.8 J1.30 J1.80
  pour Top: 1.98,18.67 3.1,18.67 3.1,11.18 1.98,11.18
AIN1  (via drill 0.35)
  Top 0.152: v116.71,15.75 116.71,16.14 115.95,16.89 U1.20 115.95,18.03 116.77,18.85 RN1.4
  Bottom 0.152: v116.71,15.75 116.71,13.84 120.02,10.54 J1.6
AIN2  (via drill 0.35)
  Top 0.152: RN1.3 115.97,19.32 114.66,18 U1.18 114.66,15.17 115.11,14.72 115.11,13.67 v115.13,13.65
  Bottom 0.152: J1.7 115.51,13.65 v115.13,13.65
AIN3  (via drill 0.35)
  Top 0.152: RN1.2 115.17,19.28 114,18.11 U1.17 114,16.15 114.18,15.98 v114.18,14.34
  Bottom 0.152: J1.8 117.47,10.79 116.84,11.43 116.08,11.43 113.93,13.58 113.93,14.09 v114.18,14.34
AIN4  (via drill 0.35)
  Top 0.152: RN1.1 114.37,19.23 113.36,18.22 U1.16 113.36,16.06 | 113.36,16.06 v113.36,15.44 | 113.36,16.06
  Bottom 0.152: v113.36,15.44 113.48,15.31 113.48,13.14 J1.9
AIN5  (via drill 0.35)
  Top 0.152: RN2.4 112.96,18.49 112.7,18.23 U1.15 112.7,14.68 v112.78,14.61
  Bottom 0.152: v112.78,14.61 112.78,12.95 114.94,10.79 J1.10
AIN6
  Top 0.152: RN2.3 112.06,19.59 U1.14 112.06,12.02 J1.11
AIN7
  Top 0.152: RN2.2 111.41,19.65 U1.13 111.41,11.66 112.39,10.67 J1.12
AIN8
  Top 0.152: RN2.1 110.68,19.58 110.68,17.48 U1.12 110.75,10.78 J1.13
AIN9
  Top 0.152: RN3.4 107.88,18.22 U2.20 108.46,16.01 108.46,11.18 108.58,11.05 J1.15
AIN10
  Top 0.152: RN3.3 107.08,19.31 105.77,18 U2.18 105.77,14.25 107.57,12.45 107.57,8.76 J1.16
AIN11
  Top 0.152: RN3.2 106.28,19.36 105.11,18.2 U2.17 105.11,11.34 J1.17
AIN12
  Top 0.152: RN3.1 104.47,18.68 U2.16 104.47,8.82 J1.18
AOUT1
  Top 0.152: RN5.4 125.66,19.3 124.84,18.48 U3.20 124.84,16.58 125.26,16.16 126.8,16.16 127,15.95 127,12.89 125.27,11.16 125.27,10.07 124.14,8.94 124.14,8.31 122.73,6.9 122.73,6.24 121.14,4.65 120.07,4.65 J1.56
AOUT2
  Top 0.152: RN5.3 124.86,19.31 123.55,18 U3.18 123.55,12.46 124.84,11.16 124.84,10.07 123.84,9.07 123.84,8.43 122.43,7.02 122.43,6.36 121.53,5.46 120.78,5.46 119.63,6.6 J1.57
AOUT3
  Top 0.152: RN5.2 124.06,19.24 122.89,18.07 U3.17 122.89,13.41 120.14,10.65 120.14,10.02 118.92,8.8 118.92,8.14 117.47,6.69 J1.58
AOUT4
  Top 0.152: RN5.1 123.26,19.31 122.25,18.3 U3.16 122.25,13.25 119.84,10.85 119.84,10.17 118.49,8.83 118.49,8.14 117.72,7.37 116.97,7.37 J1.59
AOUT5
  Top 0.152: RN6.4 121.78,19.62 121.78,18.18 121.59,18 U3.15 121.59,13.11 119.85,11.37 118.31,11.37 117.79,10.85 117.79,10.17 116.46,8.84 116.46,8.19 114.94,6.67 J1.60
AOUT6
  Top 0.152: RN6.3 120.94,19.59 U3.14 120.94,12.95 119.67,11.67 118.12,11.67 117.49,11.04 117.49,10.3 115.95,8.76 115.95,8.14 115.05,7.24 114.3,7.24 J1.61
AOUT7
  Top 0.152: RN6.2 120.3,19.65 U3.13 120.3,12.79 119.54,12.04 116.45,12.04 115.19,10.78 115.19,10.13 113.92,8.87 113.92,8.23 112.39,6.71 J1.62
AOUT8
  Top 0.152: RN6.1 119.45,18.46 119.64,18.27 U3.12 119.64,12.7 119.35,12.41 116.26,12.41 114.81,10.96 114.81,10.22 113.41,8.83 113.41,8.19 112.65,7.43 111.95,7.43 J1.63
AOUT9  (via drill 0.35)
  Top 0.152: RN7.4 98.99,18.22 U4.20 98.17,16 v98.55,15.62
  Bottom 0.152: v98.55,15.62 98.55,13.46 99.06,12.95 101.98,12.95 102.49,12.45 108.2,12.45 109.86,10.79 109.86,10.16 111.12,8.89 111.12,8.26 109.86,6.99 108.58,6.99 J1.65
AOUT10  (via drill 0.35)
  Top 0.152: RN7.3 98.19,19.31 96.88,18 U4.18 96.9,17.38 96.9,15.51 97.35,15.06 v97.35,13.79
  Bottom 0.152: v97.35,13.79 97.35,12.57 101.73,12.57 102.36,11.94 106.17,11.94 107.31,10.79 107.31,10.16 108.58,8.89 108.58,8.26 107.31,6.99 J1.66
AOUT11  (via drill 0.35)
  Top 0.152: RN7.2 97.39,19.36 96.22,18.2 U4.17 96.22,14.9 v96.52,14.61
  Bottom 0.152: v96.52,14.61 96.52,12.83 97.16,12.19 101.47,12.19 102.23,11.43 104.14,11.43 104.78,10.79 104.78,10.16 106.05,8.89 J1.67
AOUT12  (via drill 0.35)
  Top 0.152: RN7.1 95.58,18.68 U4.16 95.58,14.04 v95.77,13.85
  Bottom 0.152: v95.77,13.85 95.77,13.07 97.03,11.81 101.22,11.81 102.23,10.79 102.23,10.16 103.5,8.89 103.5,8.26 104.78,6.99 J1.68
ARX1
  Top 0.152: OR1.3 9.14,65.53 8,64.39 8,63.12 8.76,62.36 9.91,62.36 10.54,61.72 10.54,60.45 9.91,59.82 8.76,59.82 7.87,58.93 7.87,53.59 CON1.D3
ARX2
  Top 0.152: OR2.3 9.14,54.36 CON1.D4
ATX1
  Top 0.152: OT1.1 9.14,49.28 CON1.C3
ATX2
  Top 0.152: CON1.C4 10.16,46.23 10.67,45.72 10.67,44.69 9.93,43.95 8.39,43.95 7.62,43.18 7.62,41.91 8.26,41.27 9.53,41.27 10.67,40.13 10.67,35.18 OT2.1
BCKI  (via drill 0.35)
  Top 0.152: U5.13 85.96,17.45 RN9.2 85.96,18.61 v85.98,18.59
  Bottom 0.152: J1.3 123.9,10.52 124.82,11.43 124.82,15.85 122.07,18.59 v85.98,18.59
GND  (via drill 0.35)
  Top 0.152: C2.2 4.72,14.02 4.72,16.46 C1.2 4.72,16.61 4.72,18.75 5.03,19.05 | 5.03,19.05 5.03,21.49 CON1.B2 5.03,21.64 5.03,28.35 6.48,28.35 | 5.03,19.05 CON1.A2 | 81.23,51.99 81.23,53.34 CON1.D32 | 81.23,51.99 81.23,50.9 CON1.C32 | 92.51,51.99 92.51,52.88 P1.13 | 92.51,51.99 92.51,51.05 P1.11 92.51,50.9 92.51,49.07 P1.9 92.51,48.92 92.51,47.09 P1.7 92.51,46.94 92.51,45.11 P1.5 92.51,44.96 92.51,43.13 P1.3 92.51,42.98 92.51,41 P1.1 | 92.51,51.99 81.23,51.99 | C14.2 100.43,14.48 101.19,15.24 101.19,17.37 U2.11 101.19,17.53 99.97,18.75 99.97,26.67 | v92.2,26.67 92.14,26.61 C10.2 | C8.2 108.8,26.96 v107.95,27.81 | v99.97,27.74 99.97,26.67 | 99.97,26.67 C9.2 | 98.45,7.56 98.45,10.36 J1.23 | 98.45,7.56 98.45,6.71 J1.73 | 109.88,7.56 109.88,8.38 J1.14 109.73,8.53 109.73,10.67 109.42,10.97 109.42,14.48 C13.2 109.42,14.63 110.03,15.24 110.03,17.37 U1.11 109.97,17.64 109.97,20.12 110.19,20.33 117.26,20.33 117.81,20.88 | 109.88,7.56 109.88,4.72 J1.64 | 109.88,7.56 98.45,7.56 | C12.2 118.42,14.63 118.87,15.09 118.87,17.37 U3.11 118.87,17.53 118.87,19.81 118.72,19.96 | 118.72,19.96 117.81,20.88 | 117.81,20.88 117.2,21.49 117.2,23.47 117.65,23.93 117.65,26.67 C7.2 | J1.55 121.31,6.71 121.31,10.36 J1.5 | 127.71,15.24 127.71,11.73 126.49,10.52 J1.1 126.34,10.36 126.34,6.71 J1.51 126.49,6.55 131.98,6.55 J1.102 | 126.34,20.33 126.34,17.23 127.71,15.86 127.71,15.24 | 126.34,20.33 126.34,26.67 C6.2 | 127.71,15.24 C11.2 | 118.72,19.96 119.09,20.33 126.34,20.33 | 76.81,5.64 76.81,8.38 J1.40 76.83,10.79 79.5,13.46 82.55,13.46 84.7,15.62 U5.11 | 76.81,5.64 76.81,4.72 J1.90 | U4.11 92.33,15.28 C15.2 91.64,14.58 v91.64,12.55
  Top 0.152: CON1.C17 43.13,50.9 43.13,53.34 CON1.D17 36.83,59.69 14.39,59.69 C4.2 12.73,61.41 15,61.41 15.73,62.14 15.73,65.78 9.14,72.37 OR1.2 | CON1.A16 40.69,19.05 40.69,21.49 CON1.B16 43.13,24.08 43.13,28.35 14.19,28.35 | 64.16,6.55 64.16,8.38 J1.50 | 64.16,6.55 64.16,5.64 | 64.16,5.64 64.16,4.72 J1.100 | 64.16,6.55 58.52,6.55 J1.101 | 64.16,5.64 76.81,5.64 | 14.19,28.35 C16.2 C5.2 | 14.19,28.35 9.14,28.35 | 9.14,28.35 6.48,28.35 | OT2.3 9.14,28.35 | 6.48,28.35 6.52,28.39 OT2.NC2 OT2.NC1 OT1.NC2 | OT1.3 OT1.NC2 | OT1.NC2 OT1.NC1 6.52,49.36 CON1.C2 5.03,50.9 5.03,53.34 CON1.D2 6.52,54.78 OR2.NC2 9.06,61.09 OR2.2 6.6,63.63 OR2.NC1 OR1.NC2 9.06,72.39 OR1.2 | OR1.2 6.6,74.93 OR1.NC1 | OR1.2 12.28,72.39 C3.2
  Bottom 0.152: P1.1 92.46,40.97 92.46,27.74 | 92.46,27.74 92.2,27.74 v92.2,26.67 86.87,26.67 83.35,23.15 83.35,18.74 81.58,16.97 79.98,16.97 | 92.46,27.74 v99.97,27.74 100.05,27.81 v107.95,27.81 | J1.55 121.31,6.71 122.53,6.71 123.38,7.56 125.49,7.56 126.34,6.71 J1.51 | J1.40 76.96,8.38 77.88,8.38 79.35,9.86 79.35,11.73 79.98,12.37 79.98,12.7 | CON1.B32 81.28,20.95 79.98,19.66 79.98,16.97 | 79.98,12.7 79.98,16.97 | CON1.A16 40.65,19.05 53,6.71 58.37,6.71 J1.101 | J1.73 98.42,3.43 97.54,2.54 89.15,2.54 88.39,3.3 88.39,6.55 J1.81 88.24,6.71 88.24,10.36 J1.31 88.27,11.66 87.22,12.7 79.98,12.7 | J1.23 97.79,11.05 96.65,11.05 95.23,12.47 91.72,12.47 v91.64,12.55
  pour Top (rank 3): 0,99.06 161.29,99.06 161.29,-1.27 -1.27,-1.27 -1.27,99.06
  pour Bottom: -1.27,100.33 162.56,100.33 162.56,-2.54 -1.27,-2.54 -3.81,0 -3.81,97.79
MIDIN1
  Top 0.152: RN4.3 103.17,19.59 U2.14 103.17,15.66 102.92,15.42 102.92,13.16 101.13,11.37 97.93,11.37 97.16,10.59 J1.24
MIDIN2
  Top 0.152: RN4.2 102.52,19.65 U2.13 102.52,13.18 101.11,11.78 97.25,11.78 J1.25
MIDIN3
  Top 0.152: RN4.1 101.67,18.46 101.86,18.27 U2.12 101.86,12.96 101.09,12.19 96.28,12.19 94.92,10.83 94.92,9.27 94.61,8.97 J1.26
MIDIN4
  Top 0.152: J1.27 92.3,11.46 89.44,11.46 88.93,11.97 87.31,13.6 U5.15 87.31,19.44 RN9.4
MIDIN5
  Top 0.152: RN4.4 104,19.62 104,18.18 103.81,18 U2.15 103.81,10.72 J1.19
MIDOUT1  (via drill 0.35)
  Top 0.152: RN8.3 94.28,19.59 U4.14 94.28,12.15 v94.61,11.81
  Bottom 0.152: v94.61,11.81 94.61,10.16 95.89,8.89 95.89,8.26 97.16,6.99 J1.74
MIDOUT2
  Top 0.152: RN8.2 93.62,19.65 U4.13 93.62,11.94 94.61,10.95 94.61,9.89 93.6,8.88 93.6,8.14 95.14,6.6 J1.75
MIDOUT3
  Top 0.152: RN8.1 92.78,18.46 92.97,18.27 U4.12 92.97,12.16 94.3,10.83 94.3,10.01 93.29,9 93.29,8.02 94.61,6.69 J1.76
MIDOUT4
  Top 0.152: J1.77 92.71,7.24 91.83,7.24 90.81,8.27 90.81,8.76 89.53,10.03 89.53,10.67 86.66,13.55 U5.14 86.66,19.59 RN9.3
MIDOUT5  (via drill 0.35)
  Top 0.152: RN8.4 95.11,19.62 95.11,18.18 94.92,18 U4.15 94.92,13.28 v94.94,13.26
  Bottom 0.152: v94.94,13.26 96.77,11.43 99.06,11.43 99.69,10.79 99.69,10.16 100.97,8.89 100.97,8.26 102.23,6.99 103.5,6.99 J1.69
N$1
  Bottom 0.152: P1.2 90.18,40.42 90.18,32.08 82.55,24.45 82.55,20.22 81.38,19.05 CON1.A32
N$2
  Bottom 0.152: P1.4 90.37,43.13 82.45,51.05 82.45,51.33 81.76,52.02 80.11,52.02 78.79,53.34 CON1.D31
N$3
  Bottom 0.152: CON1.B31 88.91,31.76 88.91,40.96 89.95,41.99 91.14,41.99 91.44,42.29 91.44,43.99 P1.6
N$4
  Top 0.152: CON1.C31 82.45,47.09 90.37,47.09 P1.8
N$5  (via drill 0.35)
  Top 0.152: P1.10 90.53,48.99 91.44,48.08 91.44,46.41 91.02,45.99 89.73,45.99 89.41,45.67 89.41,39.5 v89.53,39.37
  Bottom 0.152: CON1.A31 78.74,19.43 80.01,20.7 80.01,22.38 89.53,31.91 v89.53,39.37
N$7
  Top 0.508: L1.2 12.74,74.55 C3.1 9.56,74.51 OR1.1
N$8
  Top 0.508: L2.2 12.74,63.12 C4.1 9.69,63.08 OR2.1
OE  (via drill 0.35)
  Top 0.152: v110.03,22.1 110.03,23.16 U1.10 | v117.81,23.16 118.87,23.16 U3.10 | v55.88,15.16 81.03,15.16 84.33,18.47 v84.33,22.15 84.33,22.86 U5.10 | U2.10 v101.22,22.1 | U4.10 92.35,23.21 v92.35,22.1
  Bottom 0.152: v117.81,23.16 111.1,23.16 v110.03,22.1 v101.22,22.1 v92.35,22.1 84.38,22.1 v84.33,22.15 | CON1.A22 v55.88,15.16
WCKI
  Top 0.152: J1.2 125.09,6.27 123.83,5 123.83,4.01 122.35,2.54 90.81,2.54 90.81,4.95 89.53,6.22 89.53,6.86 88.27,8.13 88.27,8.89 87.02,10.13 87.02,10.69 85.36,12.36 U5.12 85.36,19.5 RN9.1

### Text on the board
tNames: AudioXtreamer / YAMAHA 01x USB/Opt v1.0 / github.com/eltortugo